# Altium schematic sheet Moter_driver.SchDoc
size A4; SheetNumber: 3; SheetTotal: 6
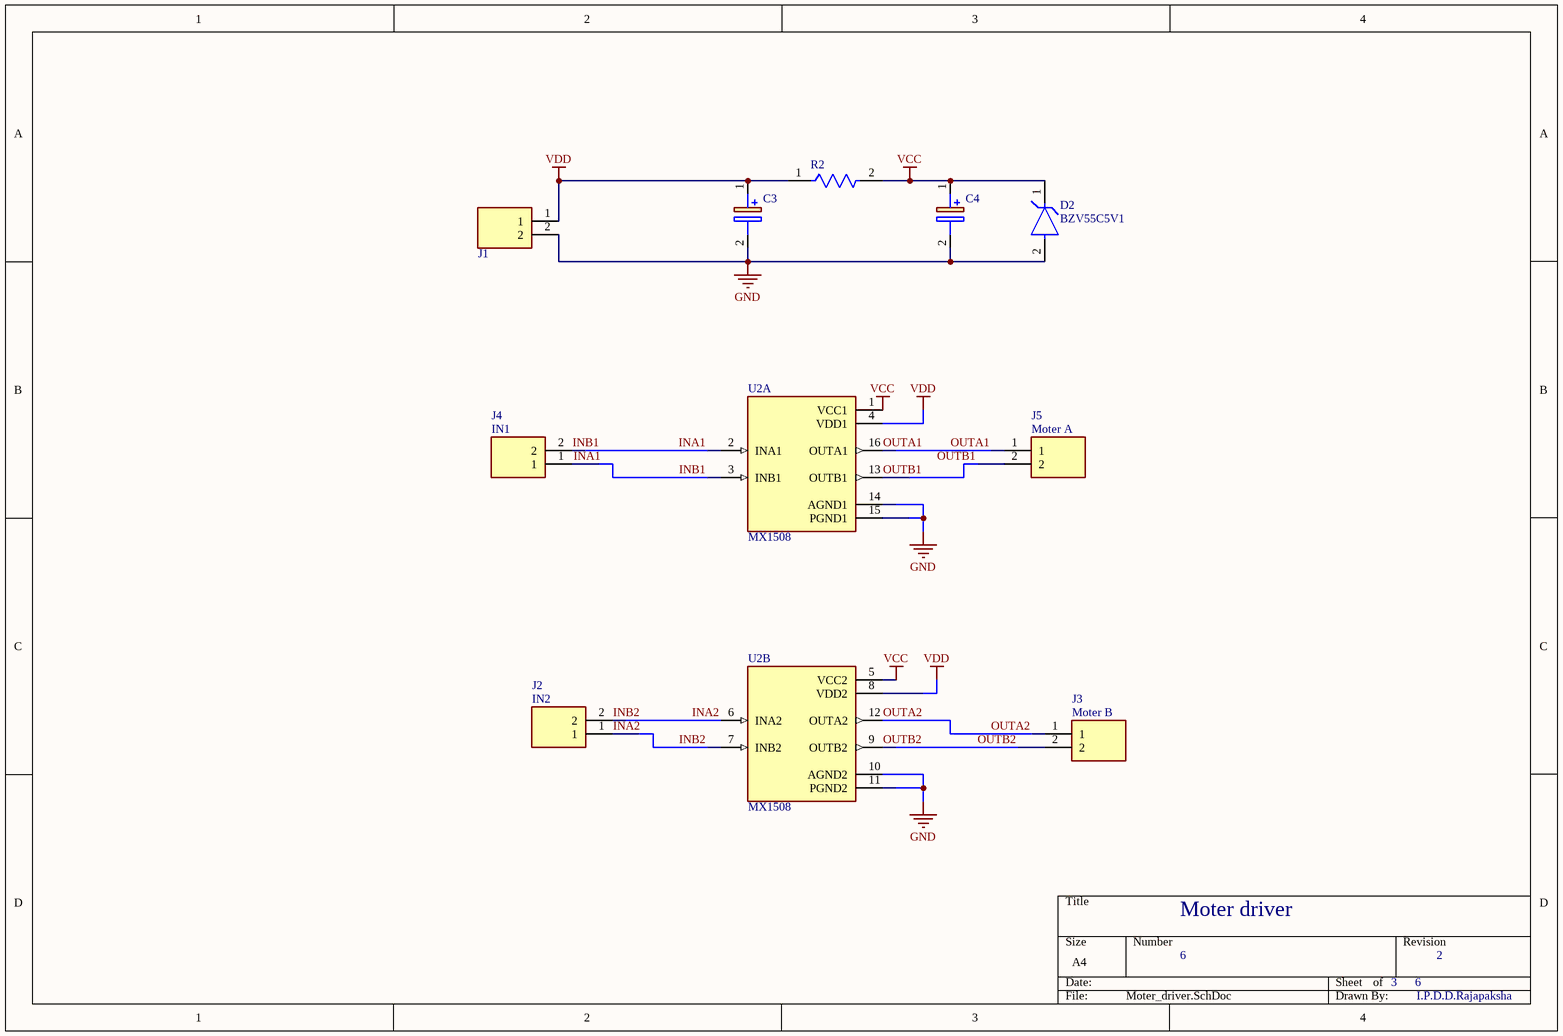
[diagram p0: Moter_driver.SchDoc]

## Parts
C3  EEV107M016S9GAA  [CAPAE660X565N]  (value not drawn)
C4  EEV107M016S9GAA  [CAPAE660X565N]  (value not drawn)
D2  BZV55C5V1  [FP-DO-213AA-MFG]
J1  M20-9990246  [HDRV2W66P0X254_1X2_508X254X874P]  (value not drawn)
J2  Name: IN2  [HDRV2W66P0X254_1X2_508X254X874P]  (hidden comment: M20-9990246)
J3  Parameter 1: Moter B  [HDRV2W66P0X254_1X2_508X254X874P]  (hidden comment: M20-9990246)
J4  Name: IN1  [HDRV2W66P0X254_1X2_508X254X874P]  (hidden comment: M20-9990246)
J5  Parameter 1: Moter A  [HDRV2W66P0X254_1X2_508X254X874P]  (hidden comment: M20-9990246)
R2  ESR03EZPJ221  [FP-ESR03-MFG]  (value not drawn)
U2  MX1508  [SOIC127P600X177-16N]  (parts A,B of 2)

## Nets
GND: C3.2(-) C4.2(-) D2.2(A) J1.2 U2.10(AGND2) U2.11(PGND2) U2.14(AGND1) U2.15(PGND1)
VCC: C4.1(+) D2.1(C) R2.2 U2.1(VCC1) U2.5(VCC2)
VDD: C3.1(+) J1.1 R2.1 U2.4(VDD1) U2.8(VDD2)
INA1: J4.1 J4.2 U2.2(INA1) U2.3(INB1)  [also labelled INB1]
INA2: J2.1 J2.2 U2.6(INA2) U2.7(INB2)  [also labelled INB2]
OUTA1: J5.1 U2.16(OUTA1)
OUTA2: J3.1 U2.12(OUTA2)
OUTB1: J5.2 U2.13(OUTB1)
OUTB2: J3.2 U2.9(OUTB2)

## Notes on the sheet
- Moter driver
- 6
- 3      6
- 2
- I.P.D.D.Rajapaksha

## Library data of the parts
C3 C4 = EEV107M016S9GAA: Capacitor Polarised; Manufacturer_Name: KEMET; Datasheet Link: https://content.kemet.com/datasheets/KEM_A4002_EEV.pdf; Height: 5.65mm; Manufacturer_Part_Number: EEV107M016S9GAA; Mouser Part Number: 80-EEV107M016S9GAA; Mouser Price/Stock: https://www.mouser.co.uk/ProductDetail/KEMET/EEV107M016S9GAA?qs=E9QF1UCAUX60VYOwNzsOEA%3D%3D; Arrow Part Number: EEV107M016S9GAA; Arrow Price/Stock: https://www.arrow.com/en/products/eev107m016s9gaa/kemet-corporation?region=europe
D2 = CMP-00252-95809520-1: BZV55C5V1 Diode Zener Single 5.1V 5% 2-Pin DO-213AA Bag; Tolerance: 6%; Test Current: 5mA; Max Reverse Leakage Current: 2µA; Lifecycle Status: Production; RoHS: Compliant; Zener Voltage: 5.1V; Max Operating Temperature: 175°C; Element Configuration: Single; Mount: Surface Mount; Number of Pins: 2; Min Operating Temperature: -65°C; NexarPartId: 95809520; Voltage Tolerance: 6%
J1-J5 = M20-9990246: Connector; Manufacturer_Name: Harwin; Datasheet Link: https://cdn.harwin.com/pdfs/M20-999.pdf; Height: 8.74mm; Manufacturer_Part_Number: M20-9990246; Mouser Part Number: 855-M20-9990246; Mouser Price/Stock: https://www.mouser.co.uk/ProductDetail/Harwin/M20-9990246?qs=Jph8NoUxIfWjw4WmyRvzag%3D%3D
R2 = CMP-08839-028125-1: 220Ω ±5% 0.25W 0603 Anti-Surge Chip Resistor AEC-Q200; Max Power Dissipation: 250mW; Temperature Coefficient: 200ppm/°C; Resistance: 220R; Max Operating Temperature: 155°C; Resistor Type: Thick Film; Case/Package: 0603; Features: Automotive AEC-Q200; Case Code (Imperial): 0603; Series: ESR; Number of Terminations: 2; RoHS Compliant: Yes; Case Code (Metric): 1608; Tolerance: 5%; Lead Free: Lead Free; Length: 0.063inch; Height: 0.022inch; Packaging: Tape and Reel; Width: 0.031inch; Package Quantity: 1; Min Operating Temperature: -55°C
U2 = MX1508: MF: Sinotech Mixic Electronics Co., Ltd; Availability: Not in stock; Package: Package; MP: MX1508; Value: *; Check_prices: https://www.snapeda.com/parts/MX1508/Sinotech+Mixic+Electronics+Co.%252C+Ltd/view-part/?ref=eda; SnapEDA_Link: https://www.snapeda.com/parts/MX1508/Sinotech+Mixic+Electronics+Co.%252C+Ltd/view-part/?ref=snap; Price: None